# Altium schematic sheet [10] Peripheral.SchDoc: ARS Camera REV01 Peripherals (part 1 of 2)
size A3; DrawnBy: Manh Ngo Van; Engineer: Manh Ngo Van; Organization: Altium Limited; Address1: L3, 12a Rodborough Rd; Address2: Frenchs Forest; Address3: NSW; Address4: Australia 2086; DocumentNumber: 10; Revision: 1.0; SheetNumber: 10; SheetTotal: 16
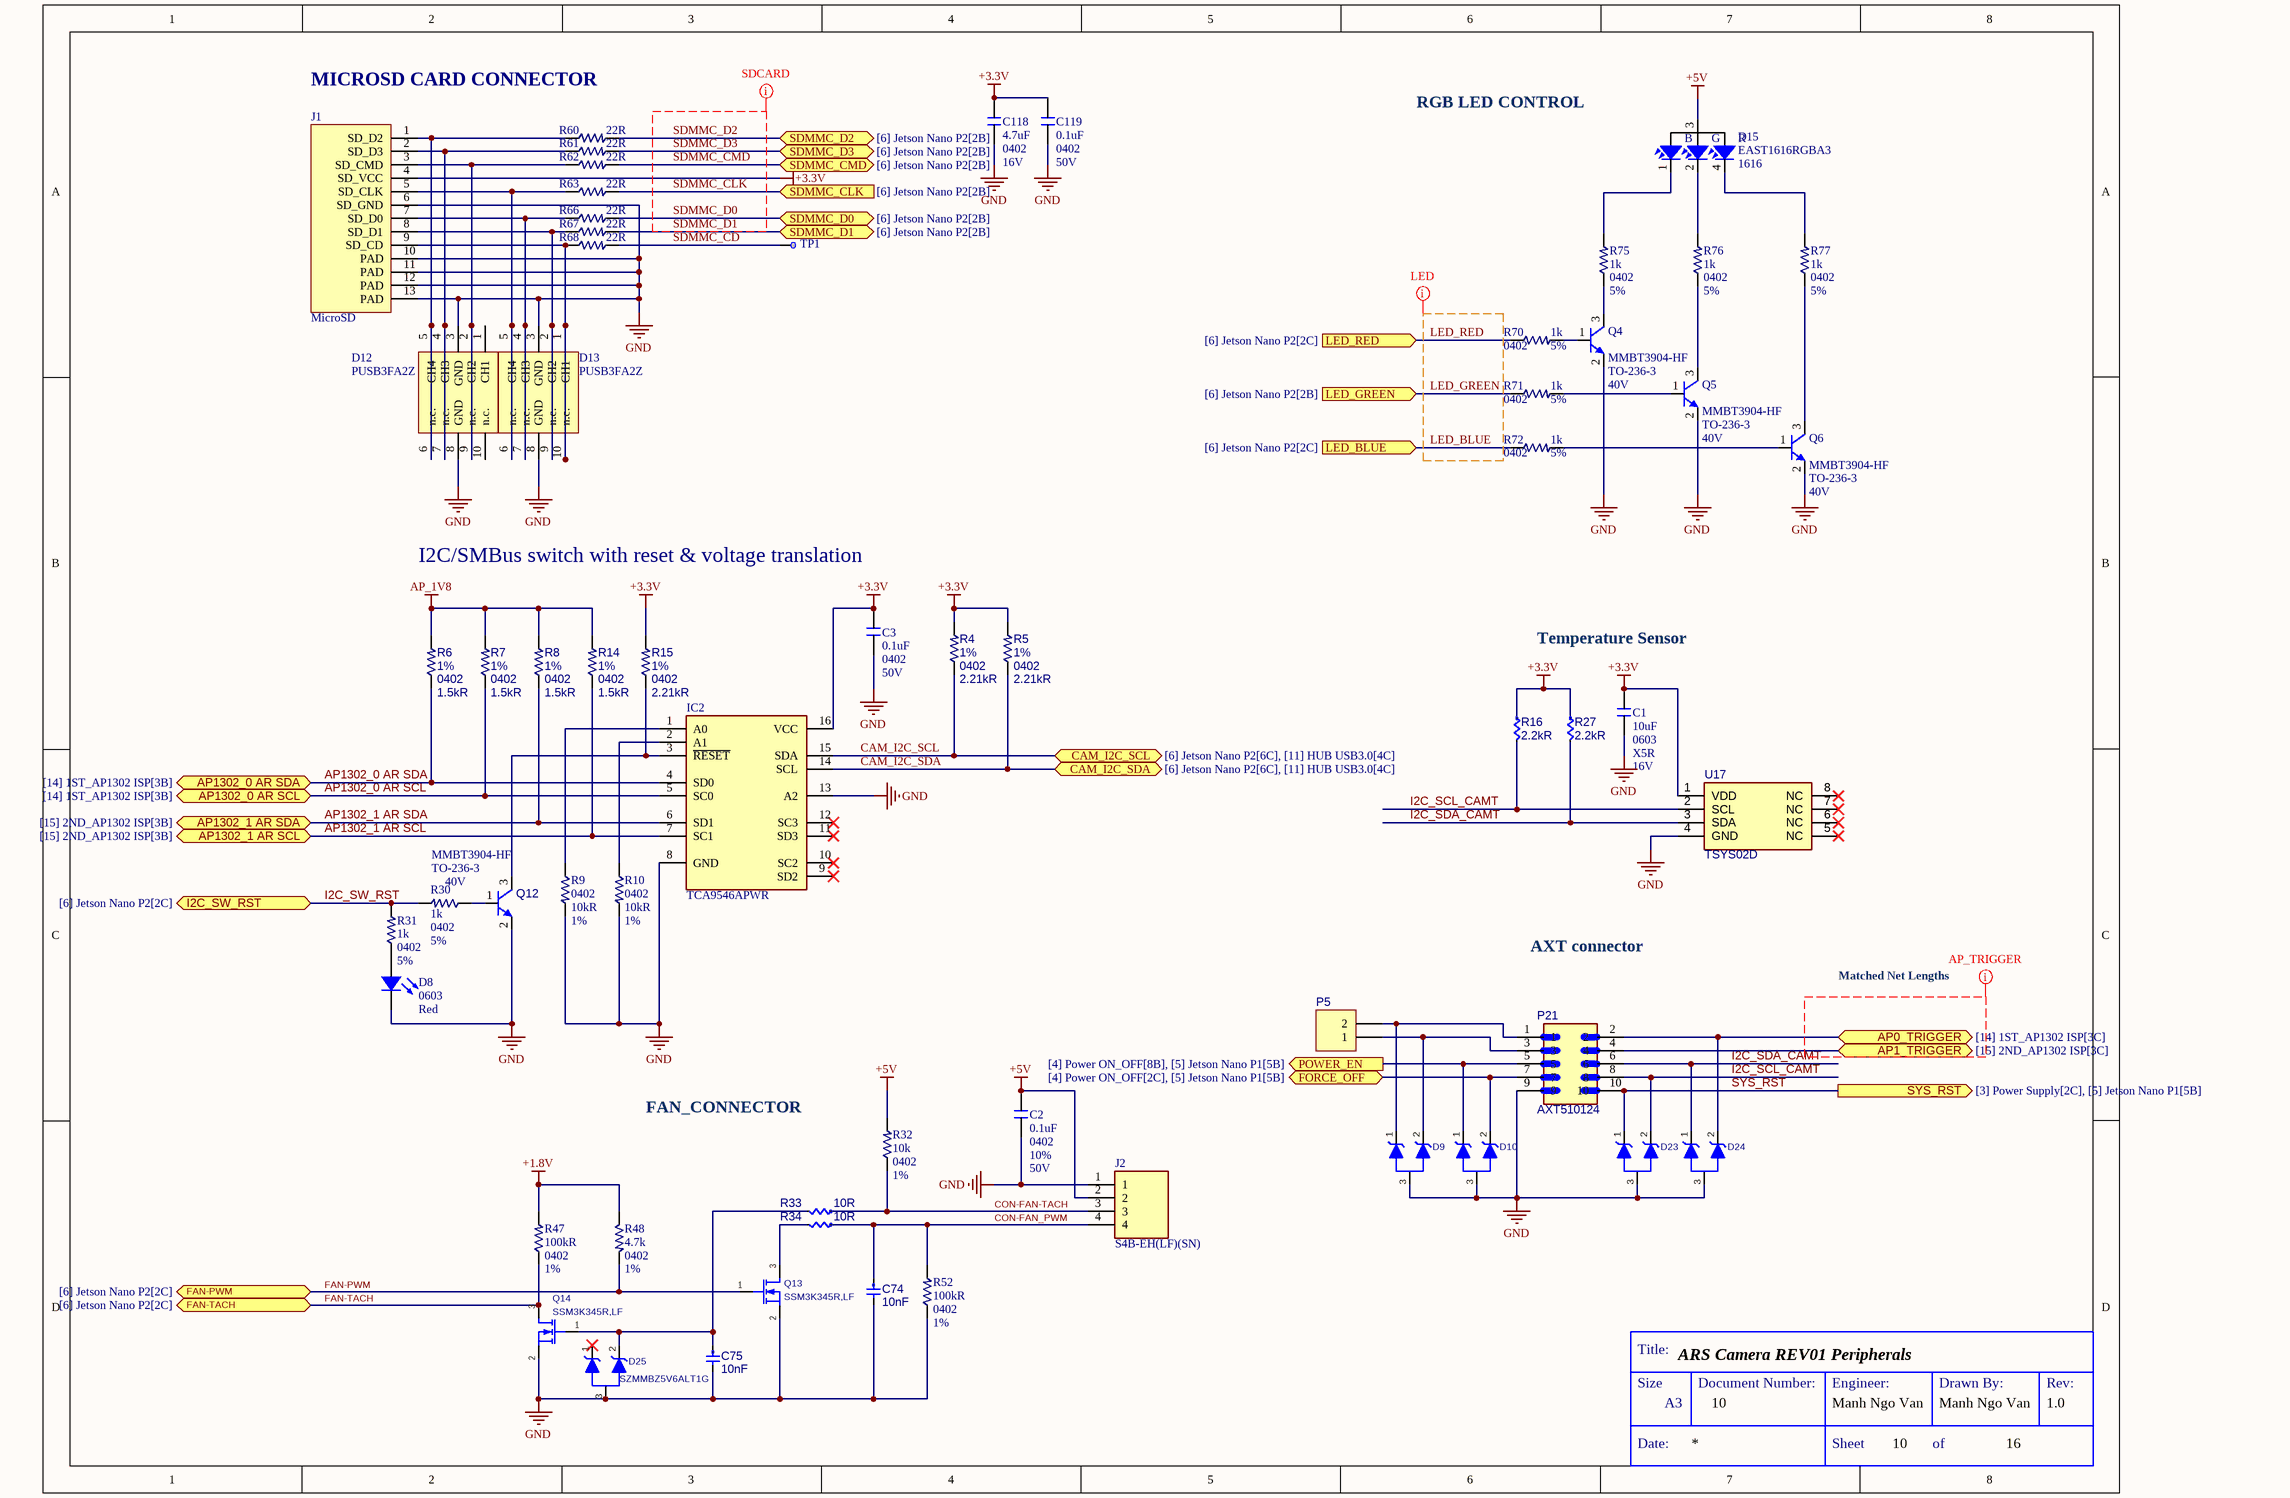
[diagram p0: [10] Peripheral.SchDoc]

## Parts
C1  10uF  Case/Package: 0603  Dielectric: X5R  Voltage Rating (DC): 16V  [C0603M]
C2  0.1uF  Case/Package: 0402  Tolerance: 10%  Voltage: 50V  [C0402M]
C3  0.1uF  Case/Package: 0402  Voltage: 50V  [C0402M]
C74  Capacitance: 10nF  [CAP0402-M]  (hidden comment: 885012205050)
C75  Capacitance: 10nF  [CAP0402-M]  (hidden comment: 885012205050)
C118  4.7uF  Case/Package: 0402  Voltage Rating: 16V  [C0402M]
C119  0.1uF  Case Code (Imperial): 0402  Voltage: 50V  [C0402M]
D8  Case/Package: 0603  Color: Red  [LED-0603]  (hidden comment: LTST-C190CKT)
D9  SZMMBZ5V6ALT1G  [ONSC-SOT-23-3-318-08_V]  (value not drawn)
D10  SZMMBZ5V6ALT1G  [ONSC-SOT-23-3-318-08_V]  (value not drawn)
D12  PUSB3FA2Z  [SON50P100X50-10N]
D13  PUSB3FA2Z  [SON50P100X50-10N]
D15  EAST1616RGBA3  Case Code (Metric): 1616  [EAST1616RGBA3]
D23  SZMMBZ5V6ALT1G  [ONSC-SOT-23-3-318-08_V]  (value not drawn)
D24  SZMMBZ5V6ALT1G  [ONSC-SOT-23-3-318-08_V]  (value not drawn)
D25  SZMMBZ5V6ALT1G  [ONSC-SOT-23-3-318-08_V]
IC2  TCA9546APWR  [TCA9546APWR]
J1  MicroSD  [TF_V3]
J2  S4B-EH(LF)(SN)  [S4B-EH(LF)(SN)_1]
P5  61300211021  [HDR1X2]  (value not drawn)
P21  AXT510124  [AXT510124]
Q4  Manufacturer Part Number 1: MMBT3904-HF  Case/Package: TO-236-3  Collector Emitter Breakdown Voltage: 40V  [SOT55P160X90-3N]
Q5  Manufacturer Part Number 1: MMBT3904-HF  Case/Package: TO-236-3  Collector Emitter Breakdown Voltage: 40V  [SOT55P160X90-3N]
Q6  Manufacturer Part Number 1: MMBT3904-HF  Case/Package: TO-236-3  Collector Emitter Breakdown Voltage: 40V  [SOT55P160X90-3N]
Q12  Manufacturer Part Number 1: MMBT3904-HF  Case/Package: TO-236-3  Collector Emitter Breakdown Voltage: 40V  [SOT55P160X90-3N]  (hidden comment: NPN)
Q13  SSM3K345R,LF  [SSM3K345R,LF-Footprint-1]
Q14  SSM3K345R,LF  [SSM3K345R,LF-Footprint-1]
R4  Tolerance: 1%  Case Code (Imperial): 0402  Resistance: 2.21kR  [R0402M]  (hidden comment: RMCF0402FT2K21)
R5  Tolerance: 1%  Case Code (Imperial): 0402  Resistance: 2.21kR  [R0402M]  (hidden comment: RMCF0402FT2K21)
R6  Tolerance: 1%  Case/Package: 0402  Resistance: 1.5kR  [R0402M]  (hidden comment: AC0402FR-071K5L)
R7  Tolerance: 1%  Case/Package: 0402  Resistance: 1.5kR  [R0402M]  (hidden comment: AC0402FR-071K5L)
R8  Tolerance: 1%  Case/Package: 0402  Resistance: 1.5kR  [R0402M]  (hidden comment: AC0402FR-071K5L)
R9  Case Code (Imperial): 0402  Resistance: 10kR  Resistance Tolerance: 1%  [R0402M]  (hidden comment: RC0402FR-0710KL)
R10  Case Code (Imperial): 0402  Resistance: 10kR  Resistance Tolerance: 1%  [R0402M]  (hidden comment: RC0402FR-0710KL)
R14  Tolerance: 1%  Case/Package: 0402  Resistance: 1.5kR  [R0402M]  (hidden comment: AC0402FR-071K5L)
R15  Tolerance: 1%  Case Code (Imperial): 0402  Resistance: 2.21kR  [R0402M]  (hidden comment: RMCF0402FT2K21)
R16  Resistance: 2.2kR  [RES0402]  (hidden comment: RC0402FR-072K2L)
R27  Resistance: 2.2kR  [RES0402]  (hidden comment: RC0402FR-072K2L)
R30  1k  Case Code (Imperial): 0402  Tolerance: 5%  [R0402M]
R31  1k  Case Code (Imperial): 0402  Tolerance: 5%  [R0402M]
R32  10k  Case Code (Imperial): 0402  Tolerance: 1%  [R0402M]
R33  Resistance: 10R  [RES0805]  (hidden comment: RNCP0805FTD10R0)
R34  Resistance: 10R  [RES0805]  (hidden comment: RNCP0805FTD10R0)
R47  100kR  Case/Package: 0402  Tolerance: 1%  [R0402M]
R48  4.7k  Case Code (Imperial): 0402  Tolerance: 1%  [R0402M]
R52  100kR  Case/Package: 0402  Tolerance: 1%  [R0402M]
R60  22R  [R0402M]
R61  22R  [R0402M]
R62  22R  [R0402M]
R63  22R  [R0402M]
R66  22R  [R0402M]
R67  22R  [R0402M]
R68  22R  [R0402M]
R70  1k  Case Code (Imperial): 0402  Tolerance: 5%  [R0402M]
R71  1k  Case Code (Imperial): 0402  Tolerance: 5%  [R0402M]
R72  1k  Case Code (Imperial): 0402  Tolerance: 5%  [R0402M]
R75  1k  Case Code (Imperial): 0402  Tolerance: 5%  [R0402M]
R76  1k  Case Code (Imperial): 0402  Tolerance: 5%  [R0402M]
R77  1k  Case Code (Imperial): 0402  Tolerance: 5%  [R0402M]
TP1  TP  [Test point]  (value not drawn)  (net tie, no BOM)
U17  TSYS02D  [TSYS02D]

## Ports
AP0_TRIGGER (bidir, see [14] 1ST_AP1302 ISP[3C]), AP1_TRIGGER (bidir, see [15] 2ND_AP1302 ISP[3C]), AP1302_0 AR SCL (bidir, see [14] 1ST_AP1302 ISP[3B]), AP1302_0 AR SDA (bidir, see [14] 1ST_AP1302 ISP[3B]), AP1302_1 AR SCL (bidir, see [15] 2ND_AP1302 ISP[3B]), AP1302_1 AR SDA (bidir, see [15] 2ND_AP1302 ISP[3B]), CAM_I2C_SCL (bidir, see [6] Jetson Nano P2[6C], [11] HUB USB3.0[4C]), CAM_I2C_SDA (bidir, see [6] Jetson Nano P2[6C], [11] HUB USB3.0[4C]), FAN-PWM (bidir, see [6] Jetson Nano P2[2C]), FAN-TACH (bidir, see [6] Jetson Nano P2[2C]), FORCE_OFF (bidir, see [4] Power ON_OFF[2C], [5] Jetson Nano P1[5B]), I2C_SW_RST (bidir, see [6] Jetson Nano P2[2C]), LED_BLUE (in, see [6] Jetson Nano P2[2C]), LED_GREEN (in, see [6] Jetson Nano P2[2B]), LED_RED (in, see [6] Jetson Nano P2[2C]), POWER_EN (out, see [4] Power ON_OFF[8B], [5] Jetson Nano P1[5B]), SDMMC_CLK (in, see [6] Jetson Nano P2[2B]), SDMMC_CMD (bidir, see [6] Jetson Nano P2[2B]), SDMMC_D0 (bidir, see [6] Jetson Nano P2[2B]), SDMMC_D1 (bidir, see [6] Jetson Nano P2[2B]), SDMMC_D2 (bidir, see [6] Jetson Nano P2[2B]), SDMMC_D3 (bidir, see [6] Jetson Nano P2[2B]), SYS_RST (out, see [3] Power Supply[2C], [5] Jetson Nano P1[5B])

## Nets
+1.8V: R47.1 R48.2
+3.3V: C1.2 C3.1 C118.1 C119.2 IC2.16(VCC) J1.4(SD_VCC) R4.1 R5.1 R15.1 R16.1 R27.1 U17.1(VDD)
+5V: C2.1 D15.3(VDD) J2.2 R32.1
AP_1V8: R6.1 R7.1 R8.1 R14.1
GND: C1.1 C2.2 C3.2 C74.2 C75.2 C118.2 C119.1 D8.2(K) D9.3(A) D10.3(A) D12.3(GND) D12.8(GND) D13.3(GND) D13.8(GND) D23.3(A) D24.3(A) D25.3(A) IC2.8(GND) IC2.13(A2) J1.6(SD_GND) J1.10(PAD) J1.11(PAD) J1.12(PAD) J1.13(PAD) J2.1 P21.9 Q4.2(E) Q5.2(E) Q6.2(E) Q12.2(E) Q13.2(S) Q14.2(S) R9.1 R10.1 R52.2 U17.4(GND)
AP0_TRIGGER: D24.2(K2) P21.2 ; port AP0_TRIGGER
AP1_TRIGGER: P21.4 ; port AP1_TRIGGER
AP1302_0 AR SCL: IC2.5(SC0) R7.2 ; port AP1302_0 AR SCL
AP1302_0 AR SDA: IC2.4(SD0) R6.2 ; port AP1302_0 AR SDA
AP1302_1 AR SCL: IC2.7(SC1) R14.2 ; port AP1302_1 AR SCL
AP1302_1 AR SDA: IC2.6(SD1) R8.2 ; port AP1302_1 AR SDA
CAM_I2C_SCL: IC2.15(SDA) R4.2 ; port CAM_I2C_SCL
CAM_I2C_SDA: IC2.14(SCL) R5.2 ; port CAM_I2C_SDA
CON-FAN-TACH: J2.3 R32.2 R33.1
CON-FAN_PWM: C74.1 J2.4 R34.1 R52.1
FAN-PWM: Q13.1(G) R48.1 ; port FAN-PWM
FAN-TACH: Q14.3(D) R47.2 ; port FAN-TACH
FORCE_OFF: D10.2(K2) P21.7 ; port FORCE_OFF
I2C_SCL_CAMT: D23.2(K2) P21.8 R16.2 U17.2(SCL)
I2C_SDA_CAMT: D24.1(K1) P21.6 R27.2 U17.3(SDA)
I2C_SW_RST: R30.1 R31.1 ; port I2C_SW_RST
LED_BLUE: R72.2 ; port LED_BLUE
LED_GREEN: R71.2 ; port LED_GREEN
LED_RED: R70.2 ; port LED_RED
POWER_EN: D10.1(K1) P21.5 ; port POWER_EN
SDMMC_CD: R68.1 TP1.1(TP)
SDMMC_CLK: R63.1 ; port SDMMC_CLK
SDMMC_CMD: R62.1 ; port SDMMC_CMD
SDMMC_D0: R66.1 ; port SDMMC_D0
SDMMC_D1: R67.1 ; port SDMMC_D1
SDMMC_D2: R60.1 ; port SDMMC_D2
SDMMC_D3: R61.1 ; port SDMMC_D3
SYS_RST: D23.1(K1) P21.10 ; port SYS_RST
NetC75_1: C75.1 D25.2(K2) Q14.1(G) R33.2
NetD8_1: D8.1(A) R31.2
NetD9_1: D9.1(K1) P5.2 P21.1
NetD9_2: D9.2(K2) P5.1 P21.3
NetD12_2: D12.2(CH2) D12.9(n.c.) J1.3(SD_CMD) R62.2
NetD12_4: D12.4(CH3) D12.7(n.c.) J1.2(SD_D3) R61.2
NetD12_5: D12.5(CH4) D12.6(n.c.) J1.1(SD_D2) R60.2
NetD13_1: D13.1(CH1) D13.10(n.c.) J1.9(SD_CD) R68.2
NetD13_2: D13.2(CH2) D13.9(n.c.) J1.8(SD_D1) R67.2
NetD13_4: D13.4(CH3) D13.7(n.c.) J1.7(SD_D0) R66.2
NetD13_5: D13.5(CH4) D13.6(n.c.) J1.5(SD_CLK) R63.2
NetD15_1: D15.1(B) R75.1
NetD15_2: D15.2(G) R76.1
NetD15_4: D15.4(R) R77.1
NetIC2_1: IC2.1(A0) R9.2
NetIC2_2: IC2.2(A1) R10.2
NetIC2_3: IC2.3(~{RESET}) Q12.3(C) R15.2
NetQ4_1: Q4.1(B) R70.1
NetQ4_3: Q4.3(C) R75.2
NetQ5_1: Q5.1(B) R71.1
NetQ5_3: Q5.3(C) R76.2
NetQ6_1: Q6.1(B) R72.1
NetQ6_3: Q6.3(C) R77.2
NetQ12_1: Q12.1(B) R30.2
NetQ13_3: Q13.3(D) R34.2

Not connected (* = marked no-connect by the designer): D12 1(CH1) 10(n.c.); D25 1(K1)*; IC2 9(SD2)* 10(SC2)* 11(SD3)* 12(SC3)*; U17 5(NC)* 6(NC)* 7(NC)* 8(NC)*

## Layout directives
net class SDCARD; rule Matched Net Lengths [Tolerance = 20mil]: SDMMC_CLK, SDMMC_CMD, SDMMC_D0, SDMMC_D1, SDMMC_D2, SDMMC_D3
net class LED: LED_BLUE, LED_GREEN, LED_RED
net class AP_TRIGGER; rule Matched Net Lengths [Tolerance = 10mil]: (no net found under the mark)

## Notes on the sheet
- MICROSD CARD CONNECTOR
- RGB LED CONTROL
- I2C/SMBus switch with reset & voltage translation
- Temperature Sensor
- AXT connector
- Matched Net Lengths
- FAN_CONNECTOR
- Title:
- Size
- Document Number:
- Engineer:
- Drawn By:
- Rev:
- Date:
- A3
- Sheet
- of